# Altium schematic sheet 21-LAN.SchDoc
size A4
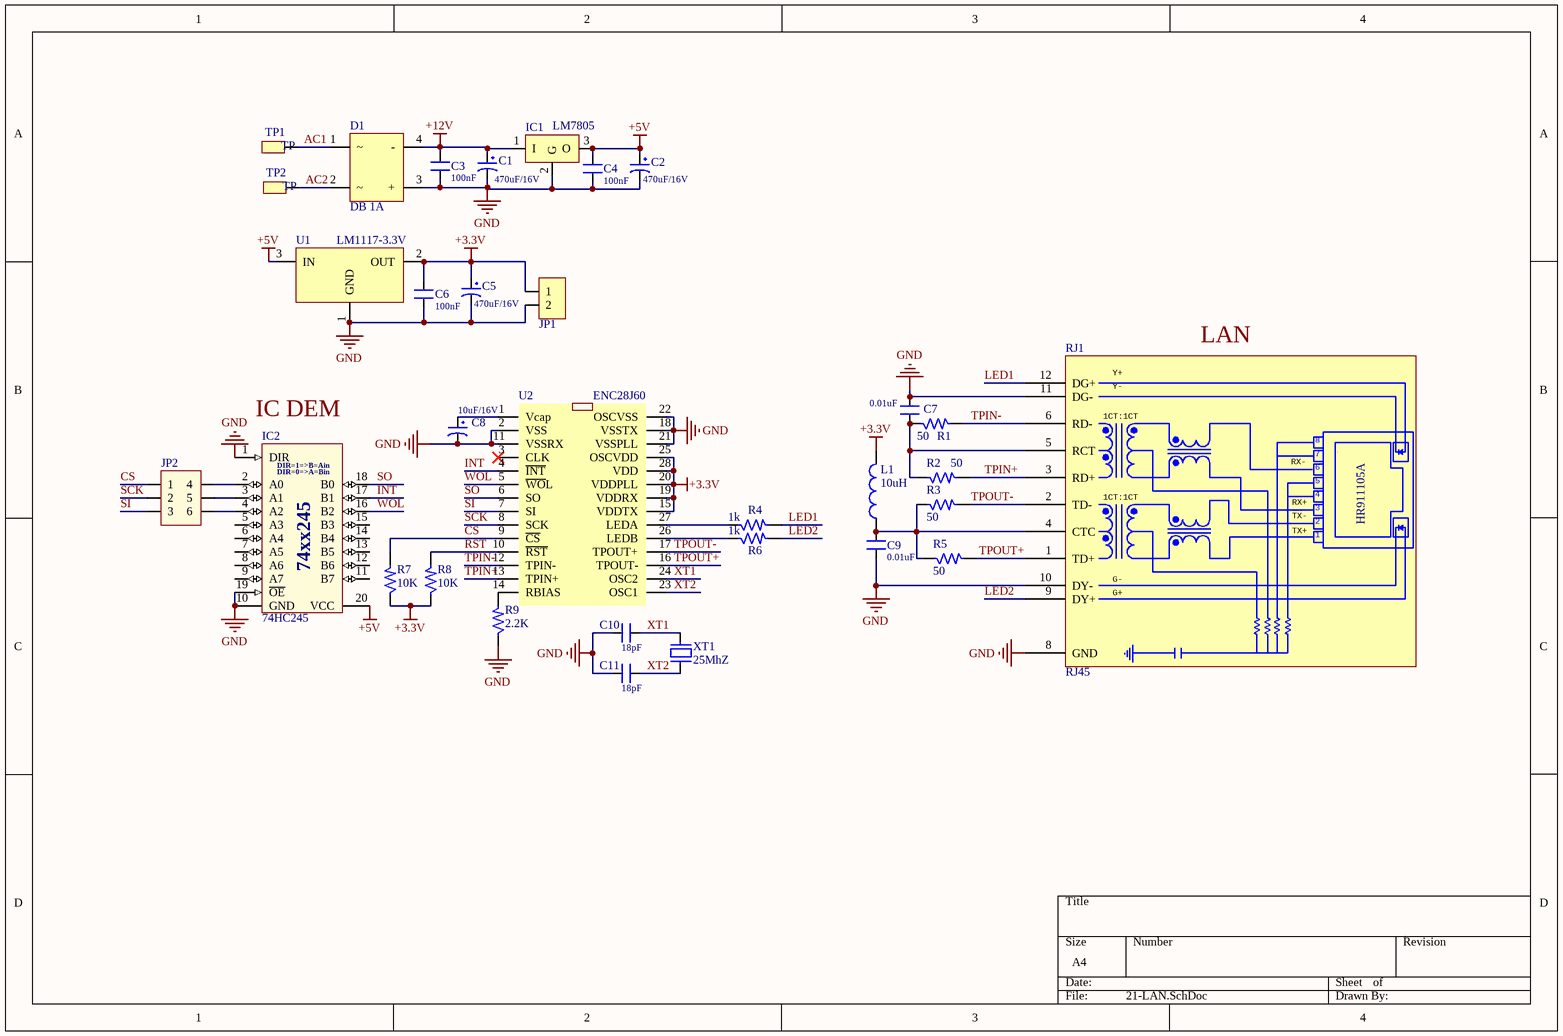
[diagram p0: 21-LAN.SchDoc]

## Parts
C1  470uF/16V  [C-TANT-7343]
C2  470uF/16V  [C-TANT-7343]
C3  100nF  [CER-0805]
C4  100nF  [CER-0805]
C5  470uF/16V  [C-TANT-7343]
C6  100nF  [CER-0805]
C7  0.01uF  [CER-0805]
C8  10uF/16V  [C-TANT-7343]
C9  0.01uF  [CER-0805]
C10  18pF  [CER-0805]
C11  18pF  [CER-0805]
D1  DB 1A  [D-DB-1A-SMD]
IC1  LM7805  [TO252-123]
IC2  74HC245  [SO-20B]
JP1  JP2  [JP2-C1T]  (value not drawn)
JP2  Connector 3x2  [JP3x2]  (value not drawn)
L1  value 10uH  [CER-0805]  (hidden comment: Inductor)
R1  50  [RES-0805]
R2  50  [RES-0805]
R3  50  [RES-0805]
R4  1k  [RES-0805]
R5  50  [RES-0805]
R6  1k  [RES-0805]
R7  10K  [RES-0805]
R8  10K  [RES-0805]
R9  2.2K  [RES-0805]
RJ1  RJ45  [RJ45 Tranfomer]
TP1  1  [TP]  (value not drawn)
TP2  1  [TP]  (value not drawn)
U1  LM1117-3.3V  [SOT223]
U2  ENC28J60  [SOP 28N]
XT1  25MhZ  [XT SMD5032]

## Nets
+3.3V: C5.1 C6.2 JP1.1 L1.2 R7.1 R8.1 U1.2(OUT) U2.15(VDDTX) U2.19(VDDRX) U2.20(VDDPLL) U2.25(OSCVDD) U2.28(VDD)
+5V: C2.1 C4.2 IC1.3(O) IC2.20(VCC) U1.3(IN)
+12V: C1.1 C3.2 D1.4(-) IC1.1(I)
GND: C1.2 C2.2 C3.1 C4.1 C5.2 C6.1 C7.2 C8.2 C9.2 C10.2 C11.2 D1.3(+) IC1.2(G) IC2.1(DIR) IC2.10(GND) IC2.19(~{OE}) JP1.2 R9.1 RJ1.8(GND) RJ1.10(DY-) RJ1.11(DG-) U1.1(GND) U2.2(VSS) U2.11(VSSRX) U2.18(VSSTX) U2.21(VSSPLL) U2.22(OSCVSS)
AC1: D1.1 TP1.TP1
AC2: D1.2 TP2.TP1
CS: JP2.1 R7.2 U2.9(~{CS})
INT: IC2.17(B1) U2.4(~{INT})
LED1: R4.2 RJ1.12(DG+)
LED2: R6.2 RJ1.9(DY+)
RST: R8.2 U2.10(~{RST})
SCK: JP2.2 U2.8(SCK)
SI: JP2.3 U2.7(SI)
SO: IC2.18(B0) U2.6(SO)
TPIN+: R2.2 RJ1.3(RD+) U2.13(TPIN+)
TPIN-: R1.2 RJ1.6(RD-) U2.12(TPIN-)
TPOUT+: R5.2 RJ1.1(TD+) U2.16(TPOUT-)
TPOUT-: R3.2 RJ1.2(TD-) U2.17(TPOUT+)
WOL: IC2.16(B2) U2.5(~{WO}L)
XT1: C10.1 U2.24(OSC2) XT1.2
XT2: C11.1 U2.23(OSC1) XT1.1
NetC7_1: C7.1 R1.1 R2.1 RJ1.5(RCT)
NetC8_1: C8.1 U2.1(Vcap)
NetC9_1: C9.1 L1.1 R3.1 R5.1 RJ1.4(CTC)
NetIC2_2: IC2.2(A0) JP2.4
NetIC2_3: IC2.3(A1) JP2.5
NetIC2_4: IC2.4(A2) JP2.6
NetR4_1: R4.1 U2.27(LEDA)
NetR6_1: R6.1 U2.26(LEDB)
NetR9_2: R9.2 U2.14(RBIAS)

Not connected (* = marked no-connect by the designer): IC2 5(A3) 6(A4) 7(A5) 8(A6) 9(A7) 11(B7) 12(B6) 13(B5) 14(B4) 15(B3); U2 3(CLK)*

## Notes on the sheet
- Labels drawn without touching a wire or pin: IC DEM, LAN
- (in symbol 74245) DIR=1=>B=Ain; DIR=0=>A=Bin; 74xx245
- (in symbol RJ45 - Tranfomer) Y+; Y-; 1CT:1CT; 7; RX-; RX+; TX-; HR911105A; TX+; G-; G+

## Library data of the parts
C1 C2 C5 C8 = Capacitor
C3 C4 C6 C7 C9-C11 = Ceramic
D1 = DB
IC1 = LM78xx: Positive Voltage Regulator; Note: Tab is connected to pin 3 (GND).; Published: 24-Aug-2001; LatestRevisionDate: 17-Jul-2002; LatestRevisionNote: Re-released for DXP Platform.; DatasheetVersion: Apr-1994; PackageVersion: Jul-1998; PackageReference: ISOWATT220AB; Publisher: Altium Limited; PackageDescription: TO, Thru-Hole, Vertical, Heatsink Mounted; 3 In-Line Leads; Pitch 2.54 mm; Pin sequence 1, 3, 2; ComponentLink1Description: Manufacturer Link; ComponentLink1URL: http://www.st.com/; ComponentLink2Description: Datasheet; ComponentLink2URL: http://www.st.com/stonline/products/literature/ds/2146/l78m05c.pdf
IC2 = 74245: Octal bus tranceiver; 3-state; Copyright by: VanDungEvn@gmail.com
JP1 = JP2: WR-PHD 2.54 mm Angled Socket Header; Manufacturer: W¨¹rth Elektronik eiSos GmbH; partNo: 613002143121; ComponentLink1 Description: Manufacturer; ComponentLink2 Description: Datasheet; NoPins: 02; Created Date: 29 March 2013; ComponentLink1URL: http://www.we-online.com; ComponentLink2URL: http://katalog.we-online.de/em/datasheet/6130xx143121.pdf; Created by: Karrer Zheng
JP2 = JP3x2: Value: Connector 3x2
L1 = Inductor: Code_IEC: 1005; Published: 8-Jun-2000; LatestRevisionDate: 29-May-2009; LatestRevisionNote: IPC-7351 Footprint Added.; PackageReference: 0402-A; Publisher: Altium Limited; PackageDescription: Chip Inductor; Code_JEITA: 0402
R1-R9 = Res1/4W
RJ1 = RJ45 - Tranfomer
TP1 TP2 = TP: CONNECT 1
U1 = LM1117: 800mA Low-Dropout Linear Regulator; Creator: Nguyen Ba Bien; Website: http://group3i.net
XT1 = XT